# Altium project Full_Bridge_Converter.PrjPcb (part 1 of 2)
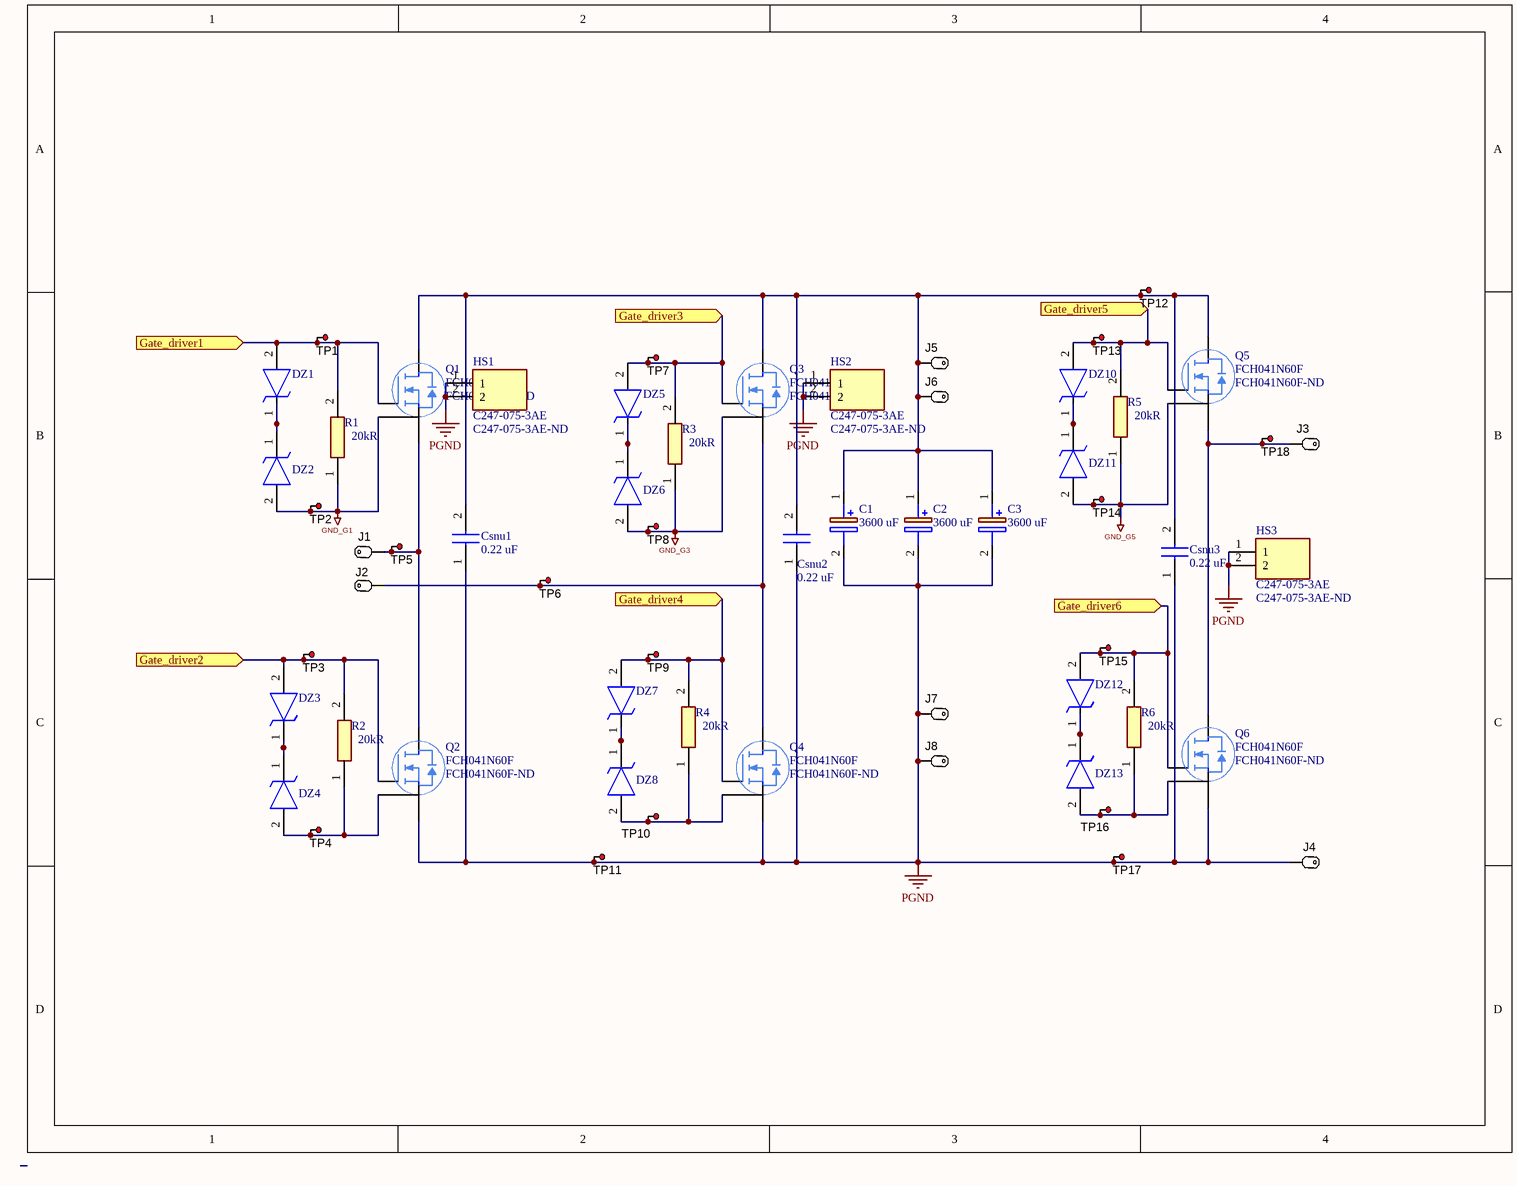
[diagram p0: Power_Card.SchDoc]
Company: Universidad de Costa Rica; Department: Escuela de Ingeniería Eléctrica; DesignByURL: Kaseng Fong Chen; Project: Convertidor de Puente H; VersionRevision: V1
5 sheets, 127 parts. Net scope: flat (ports and power ports of the same name join across sheets).
Sheets:
  Power_Card.SchDoc
  NuevosGateDriver.SchDoc
  FLYBACK.SchDoc
  Hardware.SchDoc
  Optic_PWM.SchDoc

## Sheet Power_Card.SchDoc
size Letter; SheetNumber: 1; SheetTotal: 4

### Parts
C1  3600 uF  [CAPPRD2220W900D5400H8200]
C2  3600 uF  [CAPPRD2220W900D5400H8200]
C3  3600 uF  [CAPPRD2220W900D5400H8200]
Csnu1  0.22 uF  [224PPB250K]
Csnu2  0.22 uF  [224PPB250K]
Csnu3  0.22 uF  [224PPB250K]
DZ1  SMA6J5.0A  [DIOM5026X229N]  (value not drawn)
DZ2  SMA6J5.0A  [DIOM5026X229N]  (value not drawn)
DZ3  SMA6J5.0A  [DIOM5026X229N]  (value not drawn)
DZ4  SMA6J5.0A  [DIOM5026X229N]  (value not drawn)
DZ5  SMA6J5.0A  [DIOM5026X229N]  (value not drawn)
DZ6  SMA6J5.0A  [DIOM5026X229N]  (value not drawn)
DZ7  SMA6J5.0A  [DIOM5026X229N]  (value not drawn)
DZ8  SMA6J5.0A  [DIOM5026X229N]  (value not drawn)
DZ10  SMA6J5.0A  [DIOM5026X229N]  (value not drawn)
DZ11  SMA6J5.0A  [DIOM5026X229N]  (value not drawn)
DZ12  SMA6J5.0A  [DIOM5026X229N]  (value not drawn)
DZ13  SMA6J5.0A  [DIOM5026X229N]  (value not drawn)
HS1  C247-075-3AE  Supplier Part Number 1: C247-075-3AE-ND  [C2470753AE]
HS2  C247-075-3AE  Supplier Part Number 1: C247-075-3AE-ND  [C2470753AE]
HS3  C247-075-3AE  Supplier Part Number 1: C247-075-3AE-ND  [C2470753AE]
J1  (no value)  [TE_62409-1]
J2  (no value)  [TE_62409-1]
J3  (no value)  [TE_62409-1]
J4  (no value)  [TE_62409-1]
J5  (no value)  [TE_62409-1]
J6  (no value)  [TE_62409-1]
J7  (no value)  [TE_62409-1]
J8  (no value)  [TE_62409-1]
Q1  FCH041N60F  Supplier Part Number 1: FCH041N60F-ND  [TO-247-4L_FCH041N60F]
Q2  FCH041N60F  Supplier Part Number 1: FCH041N60F-ND  [TO-247-4L_FCH041N60F]
Q3  FCH041N60F  Supplier Part Number 1: FCH041N60F-ND  [TO-247-4L_FCH041N60F]
Q4  FCH041N60F  Supplier Part Number 1: FCH041N60F-ND  [TO-247-4L_FCH041N60F]
Q5  FCH041N60F  Supplier Part Number 1: FCH041N60F-ND  [TO-247-4L_FCH041N60F]
Q6  FCH041N60F  Supplier Part Number 1: FCH041N60F-ND  [TO-247-4L_FCH041N60F]
R1  Resistance: 20kR  [RESC3216X70N]
R2  Resistance: 20kR  [RESC3216X70N]
R3  Resistance: 20kR  [RESC3216X70N]
R4  Resistance: 20kR  [RESC3216X70N]
R5  Resistance: 20kR  [RESC3216X70N]
R6  Resistance: 20kR  [RESC3216X70N]
TP1  5010  [Keystone5010]  (value not drawn)
TP2  5010  [Keystone5010]  (value not drawn)
TP3  5010  [Keystone5010]  (value not drawn)
TP4  5010  [Keystone5010]  (value not drawn)
TP5  5010  [Keystone5010]  (value not drawn)
TP6  5010  [Keystone5010]  (value not drawn)
TP7  5010  [Keystone5010]  (value not drawn)
TP8  5010  [Keystone5010]  (value not drawn)
TP9  5010  [Keystone5010]  (value not drawn)
TP10  5010  [Keystone5010]  (value not drawn)
TP11  5010  [Keystone5010]  (value not drawn)
TP12  5010  [Keystone5010]  (value not drawn)
TP13  5010  [Keystone5010]  (value not drawn)
TP14  5010  [Keystone5010]  (value not drawn)
TP15  5010  [Keystone5010]  (value not drawn)
TP16  5010  [Keystone5010]  (value not drawn)
TP17  5010  [Keystone5010]  (value not drawn)
TP18  5010  [Keystone5010]  (value not drawn)

### Ports
Gate_driver1 (in), Gate_driver2 (in), Gate_driver3 (in), Gate_driver4 (in), Gate_driver5 (in), Gate_driver6 (in)

### Nets
GND_G1: DZ2.2(A) Q1.3(S) R1.1 TP2.1
GND_G3: DZ6.2(A) Q3.3(S) R3.1 TP8.1
GND_G5: DZ11.2(A) Q5.3(S) R5.1 TP14.1
PGND: C1.2(-) C2.2(-) C3.2(-) Csnu1.1 Csnu2.1 Csnu3.1 HS1.1 HS1.2 HS2.1 HS2.2 HS3.1 HS3.2 J4.1(P1) J7.1(P1) J8.1(P1) Q2.2(Power_Source) Q4.2(Power_Source) Q6.2(Power_Source) TP11.1 TP17.1
NetC1_1: C1.1(+) C2.1(+) C3.1(+) Csnu1.2 Csnu2.2 Csnu3.2 J5.1(P1) J6.1(P1) Q1.1(D) Q3.1(D) Q5.1(D) TP12.1
NetDZ1_1: DZ1.1(K) DZ2.1(K)
NetDZ1_2: DZ1.2(A) Q1.4(G) R1.2 TP1.1 ; port Gate_driver1
NetDZ3_1: DZ3.1(K) DZ4.1(K)
NetDZ3_2: DZ3.2(A) Q2.4(G) R2.2 TP3.1 ; port Gate_driver2
NetDZ4_2: DZ4.2(A) Q2.3(S) R2.1 TP4.1
NetDZ5_1: DZ5.1(K) DZ6.1(K)
NetDZ5_2: DZ5.2(A) Q3.4(G) R3.2 TP7.1 ; port Gate_driver3
NetDZ7_1: DZ7.1(K) DZ8.1(K)
NetDZ7_2: DZ7.2(A) Q4.4(G) R4.2 TP9.1 ; port Gate_driver4
NetDZ8_2: DZ8.2(A) Q4.3(S) R4.1 TP10.1
NetDZ10_1: DZ10.1(K) DZ11.1(K)
NetDZ10_2: DZ10.2(A) Q5.4(G) R5.2 TP13.1 ; port Gate_driver5
NetDZ12_1: DZ12.1(K) DZ13.1(K)
NetDZ12_2: DZ12.2(A) Q6.4(G) R6.2 TP15.1 ; port Gate_driver6
NetDZ13_2: DZ13.2(A) Q6.3(S) R6.1 TP16.1
NetJ1_1: J1.1(P1) Q1.2(Power_Source) Q2.1(D) TP5.1
NetJ2_1: J2.1(P1) Q3.2(Power_Source) Q4.1(D) TP6.1
NetJ3_1: J3.1(P1) Q5.2(Power_Source) Q6.1(D) TP18.1

### Library data of the parts
C1-C3 = ALS70A362KE250: Capacitor Polarised; Manufacturer_Name: Kemet; Datasheet Link: https://www.mouser.co.cr/ProductDetail/KEMET/ALS70A362KE250?qs=%2Fha2pyFaduj3AQ8COxkE8lI%252BUillJnwqd3tsmY5wFt8h31rq7v%2FTZw%3D%3D; Height: 82mm; Manufacturer_Part_Number: ALS70A362KE250
Csnu1-Csnu3 = 224PPB250K: CAP FILM 0.22UF 10% 250VDC RAD; Manufacturer_Name: ILLINOIS CAPACITOR; Manufacturer: CDE Illinois Capacitor; Dielectric Material: PP; Capacitance: 220nF; Voltage Rating (DC): 250V; Voltage Rating (AC): 160V; Datasheet Link: https://componentsearchengine.com/Datasheets/1/224PPB250K.pdf; Height: 15mm; Manufacturer_Part_Number: 224PPB250K; Mouser Part Number: 598-224PPB250K; Mouser Price/Stock: https://www.mouser.com/Search/Refine.aspx?Keyword=598-224PPB250K; Supplier 1: Digi-Key; Supplier Part Number 1: 1572-1375-ND; Manufacturer Part Number: 224PPB250K; RoHS: Yes; Category: Film Capacitors; Stock 1: 173; Pricing 1: 1=1.84000, 10=1.44900, 50=1.25580, 100=1.08680, 500=0.82110, 1000=0.72450, 2500=0.67620, 5000=0.65205 (USD); Mount: Through Hole,PCB; Case/Package: Radial; Min Operating Temperature: -55°C; Max Operating Temperature: 105°C; Tolerance: 10%; Voltage Rating: 250V; Packaging: Bulk; Termination: PC Pins; Series: PPB; Length: 1.043inch; Width: 0.236inch; Height - Seated (Max): 0.591inch; Lead Pitch: 0.886inch; Lead Free: Lead Free; ComponentLink1URL: https://datasheet.ciiva.com/23627/1658054-23627330.pdf?src-supplier=Newark; ComponentLink1Description: https://datasheet.ciiva.com/23627/1658054-23627330.pdf?src-supplier=Newark; ComponentLink2URL: https://datasheet.ciiva.com/16310/ppb-16310486.pdf?src-supplier=Future+Electronics; ComponentLink2Description: https://datasheet.ciiva.com/16310/ppb-16310486.pdf?src-supplier=Future+Electronics
DZ1-DZ8 DZ10-DZ13 = SMA6J5.0A: NEXPERIA - BZV55-C15,115 - ZENER-DIODE, 15V, 0.5W, SOD-80C-2; Manufacturer_Name: LITTELFUSE; Datasheet Link: https://www.arrow.com/en/products/sma6j5.0a/littelfuse; Height: 2.29mm; Manufacturer_Part_Number: SMA6J5.0A; Supplier 1: Digi-Key; Manufacturer: Nexperia; Manufacturer Part Number: BZV55-C15,115; RoHS: Yes; Category: Zener Diodes; Stock 1: 165; Pricing 1: 1=0.19000, 10=0.17500, 100=0.09520, 500=0.05856, 1000=0.03993 (USD); RoHS Compliant: Yes; ComponentLink1URL: http://www.farnell.com/datasheets/1498690.pdf?src-supplier=Farnell; ComponentLink1Description: http://www.farnell.com/datasheets/1498690.pdf?src-supplier=Farnell; ComponentLink2URL: https://assets.nexperia.com/documents/data-sheet/BZV55_SER.pdf?src-supplier=Digi-Key; ComponentLink2Description: https://assets.nexperia.com/documents/data-sheet/BZV55_SER.pdf?src-supplier=Digi-Key; Supplier Part Number 1: 1727-4962-1-ND
HS1-HS3 = C247-075-3AE: Heatsink,  TO-247,  75 x 20.47 x 38mm,  Spring Clip Mount; Manufacturer_Name: Ohmite; Shape: Fins,Rectangular; Finish: Anodized; Thermal Resistance @ Forced Air Flow (100 LFM): 2°C/W; Datasheet Link: https://www.ohmite.com/assets/docs/sink_c.pdf; Height: 38mm; Manufacturer_Part_Number: C247-075-3AE; Supplier 1: Digi-Key; Manufacturer: Ohmite; Manufacturer Part Number: C247-075-3AE; RoHS: Yes; Category: Heat Sinks; Stock 1: 277; Pricing 1: 1=10.28000, 10=9.99900, 25=9.44360, 50=8.88800, 100=8.33250, 250=7.77700, 500=7.22150, 1000=7.08262 (USD); Mount: PC Pin,Board,Clip; Case/Package: TO-247; Weight: 1.6oz; Package Cooled: TO-247; Material: Aluminium; Color: Black; Packaging: Bulk; Package Quantity: 5; Type: Passive; Termination: Radial; Natural Thermal Resistance: 2°C/W; Series: C; Length: 75mm; Width: 1.5inch; Height Off Base: 0.71inch; REACH SVHC: Unknown; RoHS Compliant: Yes; ComponentLink1URL: https://datasheet.ciiva.com/1347/1491991-1347537.pdf?src-supplier=Element14; ComponentLink1Description: https://datasheet.ciiva.com/1347/1491991-1347537.pdf?src-supplier=Element14; ComponentLink2URL: https://datasheet.ciiva.com/30237/c-sink-30237933.pdf?src-supplier=Onlinecomponents.com; ComponentLink2Description: https://datasheet.ciiva.com/30237/c-sink-30237933.pdf?src-supplier=Onlinecomponents.com; ComponentLink3URL: https://datasheet.ciiva.com/16151/c-sink-16151064.pdf?src-supplier=Onlinecomponents.com; ComponentLink3Description: https://datasheet.ciiva.com/16151/c-sink-16151064.pdf?src-supplier=Onlinecomponents.com; ComponentLink4URL: https://datasheet.ciiva.com/14543/70024778-14543773.pdf?src-supplier=Allied+Electronics; ComponentLink4Description: https://datasheet.ciiva.com/14543/70024778-14543773.pdf?src-supplier=Allied+Electronics
J1-J8 = 62409-1: Quick Disconnect Terminal M 15.8mm 7.5mm Tin Over Copper Automotive Bag; Manufacturer: AMP - TE CONNECTIVITY; Supplier 1: Digi-Key; Supplier Part Number 1: A24742-ND; Manufacturer Part Number: 62409-1; RoHS: No; Stock 1: 8729; Pricing 1: 1=0,19000, 10=0,17800, 25=0,15200, 50=0,13320, 100=0,12360, 250=0,10936, 750=0,09035, 1500=0,08083, 8000=0,06895 (USD); ComponentLink1URL: http://www.farnell.com/datasheets/1650963.pdf?src-supplier=Farnell; ComponentLink1Description: http://www.farnell.com/datasheets/1650963.pdf?src-supplier=Farnell; ComponentLink2URL: http://www.farnell.com/datasheets/1650963.pdf?src-supplier=Element14; ComponentLink2Description: http://www.farnell.com/datasheets/1650963.pdf?src-supplier=Element14; ComponentLink3URL: http://www.farnell.com/datasheets/1650963.pdf?src-supplier=Newark; ComponentLink3Description: http://www.farnell.com/datasheets/1650963.pdf?src-supplier=Newark; ComponentLink4URL: https://www.te.com/commerce/DocumentDelivery/DDEController?Action=srchrtrv&DocNm=62409&DocType=Customer+Drawing&DocLang=English&src-supplier=Digi-Key; ComponentLink4Description: https://www.te.com/commerce/DocumentDelivery/DDEController?Action=srchrtrv&DocNm=62409&DocType=Customer+Drawing&DocLang=English&src-supplier=Digi-Key
Q1-Q6 = FCH041N60F: MOSFET 600V N-Channel MOSFET, FRFET; Manufacturer: ON Semiconductor / Fairchild; Continuous Drain Current (ID): 76A; Rds On Max: 41mR; Input Capacitance: 14.365nF; Rise Time: 66ns; Max Power Dissipation: 595W; Fall Time: 53ns; Gate to Source Voltage (Vgs): 20V; Turn-Off Delay Time: 244ns; Turn-On Delay Time: 63ns; Element Configuration: Single; Drain to Source Resistance: 36mR; Number of Elements: 1; ComponentLink3URL: https://datasheet.ciiva.com/28425/fch041n60f-28425574.pdf?src-supplier=Avnet+Europe; ComponentLink3Description: https://datasheet.ciiva.com/28425/fch041n60f-28425574.pdf?src-supplier=Avnet+Europe; Supplier 1: Digi-Key; Manufacturer Part Number: FCH041N60F; RoHS: Yes; Category: MOSFETs; Stock 1: 1157; Pricing 1: 1=9.07000, 10=8.19600, 25=7.81480, 100=6.78560, 500=6.06480 (USD); Mount: Through Hole; Case/Package: TO-247-3; Number of Pins: 3; Weight: 6.39g; Contact Plating: Tin,Matte; Min Operating Temperature: -55°C; Max Operating Temperature: 150°C; Packaging: Rail/Tube; Drain to Source Voltage (Vdss): 600V; Package Quantity: 30; Drain to Source Breakdown Voltage: 600V; Power Dissipation: 595W; Polarity: N-CHANNEL; Series: SuperFETII®; Length: 15.87mm; Width: 4.82mm; Height: 20.82mm; Radiation Hardening: No; Lead Free: Lead Free; RoHS Compliant: Yes; ComponentLink1URL: https://datasheet.ciiva.com/15043/fch041n60f-15043778.pdf?src-supplier=Digi-Key; ComponentLink1Description: https://datasheet.ciiva.com/15043/fch041n60f-15043778.pdf?src-supplier=Digi-Key; ComponentLink2URL: https://datasheet.ciiva.com/13058/fch041n60f-226495-13058758.pdf?src-supplier=Mouser; ComponentLink2Description: https://datasheet.ciiva.com/13058/fch041n60f-226495-13058758.pdf?src-supplier=Mouser
R1-R6 = RMCF1206JT20K0‎‎: RES SMD 20K OHM 5% 1/4W 1206; Manufacturer_Name: KOA Speer; Manufacturer_Part_Number: RN73H2BTTD1001B10; Manufacturer: Stackpole Electronics; Power Rating: 250mW; Temperature Coefficient: 200ppm/°C; Datasheet Link: https://www.mouser.de/datasheet/2/219/RN73H-1843478.pdf; Height: 0.7mm; Supplier 1: Digi-Key; Manufacturer Part Number: RMCF1206JT20K0; RoHS: Yes; Category: Chip SMD Resistors; Stock 1: 60988; Pricing 1: 1=0.10000, 10=0.02800, 100=0.01150, 1000=0.00518, 2500=0.00450 (USD); Mount: Surface Mount; Case/Package: 1206; Case Code (Metric): 3216; Case Code (Imperial): 1206; Contact Plating: Tin,Matte; Size Code: 1206; Min Operating Temperature: -55°C; Max Operating Temperature: 155°C; Tolerance: 5%; Packaging: Tape and Reel; Resistor Type: Thick Film; Number of Terminations: 2; Max Power Dissipation: 250mW; Features: Automotive AEC-Q200; Series: RMCF; Length: 0.126inch; Width: 0.063inch; Radiation Hardening: No; Lead Free: Lead Free; RoHS Compliant: Yes; ComponentLink1URL: http://components.arrow.com/part/dataview/43746691S7171900N1174?src-supplier=Arrow+Electronics; ComponentLink1Description: http://components.arrow.com/part/dataview/43746691S7171900N1174?src-supplier=Arrow+Electronics; ComponentLink2URL: https://www.seielect.com/catalog/SEI-RMCF_RMCP.pdf?src-supplier=Avnet; ComponentLink2Description: https://www.seielect.com/catalog/SEI-RMCF_RMCP.pdf?src-supplier=Avnet; ComponentLink3URL: https://www.seielect.com/Catalog/SEI-RMCF_RMCP.pdf?src-supplier=Digi-Key; ComponentLink3Description: https://www.seielect.com/Catalog/SEI-RMCF_RMCP.pdf?src-supplier=Digi-Key; ComponentLink4URL: https://www.seielect.com/catalog/SEI-Packaging.pdf?src-supplier=Digi-Key; ComponentLink4Description: https://www.seielect.com/catalog/SEI-Packaging.pdf?src-supplier=Digi-Key; ComponentLink5URL: http://www.seielect.com/Catalog/SEI-RMC.pdf?src-supplier=Future+Electronics; ComponentLink5Description: http://www.seielect.com/Catalog/SEI-RMC.pdf?src-supplier=Future+Electronics; Supplier Part Number 1: RMCF1206JT20K0CT-ND
TP1-TP18 = 5010: Test Point, Multipurpose, Red, TH; Manufacturer: Keystone; CompType: Test Point Loop; ContactFinish: Silver; SymbolVersion: 2008-04-04; PartNumber: 5010; PackageReference: Red Multipurpose Testpoint; RoHS: Y; MountType: TH; ComponentLink1Description: Datasheet URL; ComponentLink1URL: http://www.keyelco.com/userAssets/file/M60-2p60.pdf; Color: Red; Publisher: Texas Instruments; LatestRevisionDate: 2016-02-11; Supplier 1: Digi-Key; Supplier Part Number 1: 36-5010-ND; Supplier 2: Mouser; Supplier Part Number 2: 534-5010

## Sheet NuevosGateDriver.SchDoc
size A4; SheetNumber: 2; SheetTotal: 6
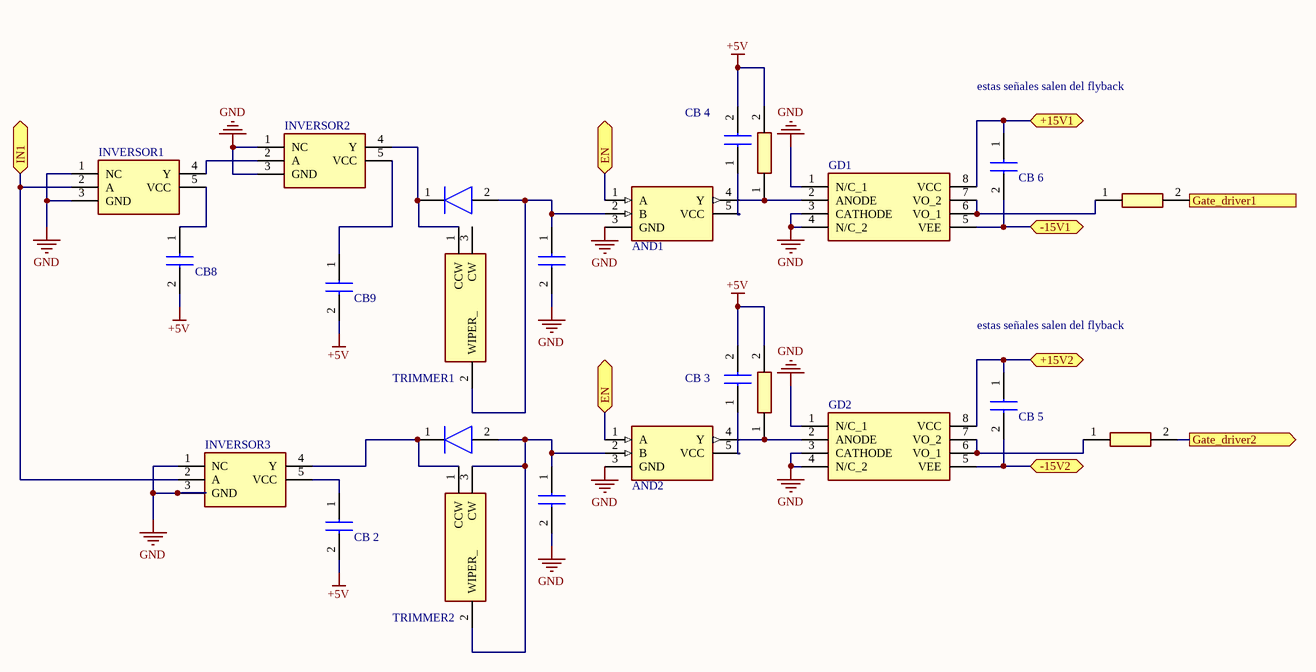
[diagram p1: NuevosGateDriver.SchDoc]

### Parts
AND1  SN74AHC1G09DCKR  [SOT65P210X110-5N]  (value not drawn)
AND2  SN74AHC1G09DCKR  [SOT65P210X110-5N]  (value not drawn)
CB8  0.1 uF  [CAPC2012X94N]  (value not drawn)
CB9  0.1 uF  [CAPC2012X94N]  (value not drawn)
CB_2  0.1 uF  [CAPC2012X94N]  (value not drawn)
CB_3  0.1 uF  [CAPC2012X94N]  (value not drawn)
CB_4  0.1 uF  [CAPC2012X94N]  (value not drawn)
CB_5  0.1 uF  [CAPC2012X94N]  (value not drawn)
CB_6  0.1 uF  [CAPC2012X94N]  (value not drawn)
CG1  C0805Y102K3RACTU  [CAPC2012X98N]  (value not drawn)
CG2  C0805Y102K3RACTU  [CAPC2012X98N]  (value not drawn)
DS1  BAS85-GS08  [BAQ33GS08]  (value not drawn)
DS2  BAS85-GS08  [BAQ33GS08]  (value not drawn)
GD1  HCPL-3120  [DIP762W65P254L965H470Q8N]  (value not drawn)
GD2  HCPL-3120  [DIP762W65P254L965H470Q8N]  (value not drawn)
GR1  RC0603JR-13100RL  [RESC1608X55N]  (value not drawn)
GR2  RC0603JR-13100RL  [RESC1608X55N]  (value not drawn)
GR3  RC0603JR-13100RL  [RESC1608X55N]  (value not drawn)
GR4  RC0603JR-13100RL  [RESC1608X55N]  (value not drawn)
INVERSOR1  SN74AHC1G14DRLR  [SOTFL50P160X60-5N]  (value not drawn)
INVERSOR2  SN74AHC1G14DRLR  [SOTFL50P160X60-5N]  (value not drawn)
INVERSOR3  SN74AHC1G14DRLR  [SOTFL50P160X60-5N]  (value not drawn)
TRIMMER1  ST-4ETB203  [ST4ETB203]  (value not drawn)
TRIMMER2  ST-4ETB203  [ST4ETB203]  (value not drawn)

### Ports
+15V1 (bidir), +15V2 (bidir), -15V1 (bidir), -15V2 (bidir), EN (bidir), Gate_driver1 (out), Gate_driver2 (out), IN1 (bidir)

### Nets
+5V: CB8.2 CB9.2 CB_2.2 CB_3.2 CB_4.2 GR1.2 GR2.2
GND: AND1.3(GND) AND2.3(GND) CG1.2 CG2.2 GD1.1(N/C_1) GD1.3(CATHODE) GD1.4(N/C_2) GD2.1(N/C_1) GD2.3(CATHODE) GD2.4(N/C_2) INVERSOR1.1(NC) INVERSOR1.3(GND) INVERSOR2.1(NC) INVERSOR2.3(GND) INVERSOR3.1(NC) INVERSOR3.3(GND)
NetAND1_1: AND1.1(A) AND2.1(A) ; port EN
NetAND1_2: AND1.2(B) CG1.1 DS1.2(A) TRIMMER1.2(WIPER_)
NetAND1_4: AND1.4(Y) GD1.2(ANODE) GR1.1
NetAND1_5: AND1.5(VCC) CB_4.1
NetAND2_2: AND2.2(B) CG2.1 DS2.2(A) TRIMMER2.2(WIPER_) TRIMMER2.3(CW)
NetAND2_4: AND2.4(Y) GD2.2(ANODE) GR2.1
NetAND2_5: AND2.5(VCC) CB_3.1
NetCB8_1: CB8.1 INVERSOR1.5(VCC)
NetCB9_1: CB9.1 INVERSOR2.5(VCC)
NetCB_2_1: CB_2.1 INVERSOR3.5(VCC)
NetCB_5_1: CB_5.1 GD2.8(VCC) ; port +15V2
NetCB_5_2: CB_5.2 GD2.5(VEE) ; port -15V2
NetCB_6_1: CB_6.1 GD1.8(VCC) ; port +15V1
NetCB_6_2: CB_6.2 GD1.5(VEE) ; port -15V1
NetDS1_1: DS1.1(K) INVERSOR2.4(Y) TRIMMER1.1(CCW)
NetDS2_1: DS2.1(K) INVERSOR3.4(Y) TRIMMER2.1(CCW)
NetDZ1_2: GR3.2 ; port Gate_driver1
NetDZ3_2: GR4.2 ; port Gate_driver2
NetGD1_6: GD1.6(VO_1) GD1.7(VO_2) GR3.1
NetGD2_6: GD2.6(VO_1) GD2.7(VO_2) GR4.1
NetINVERSOR1_2: INVERSOR1.2(A) INVERSOR3.2(A) ; port IN1
NetINVERSOR1_4: INVERSOR1.4(Y) INVERSOR2.2(A)

Not connected (* = marked no-connect by the designer): TRIMMER1 3(CW)

### Notes on the sheet
- estas señales salen del flyback

### Library data of the parts
AND1 AND2 = SN74AHC1G09DCKR: TEXAS INSTRUMENTS         SN74AHC1G09DCKR             AND Gate, ACH Family, 2 Input, 1 Gate, 25 mA, 2V to 5.5V, SC-70-5; Quiescent Current: 1uA; Output Current: 25mA; Number of Inputs: 2; Propagation Delay: 7.5ns; Number of Outputs: 1; Low Level Output Current: 8mA; Datasheet Link: http://www.ti.com/lit/gpn/sn74ahc1g09; Height: 1.1mm; Manufacturer_Name: Texas Instruments; Manufacturer_Part_Number: SN74AHC1G09DCKR; Supplier 1: Digi-Key; Manufacturer: Texas Instruments; Manufacturer Part Number: SN74AHC1G09DCKR; RoHS: Yes; Category: Logic Gates; Stock 1: 19244; Pricing 1: 1=0.40000, 10=0.29700, 25=0.25960, 100=0.16810, 250=0.13912, 500=0.11130, 1000=0.08533 (USD); Mount: Surface Mount; Case/Package: SC; Number of Pins: 5; Min Operating Temperature: -55°C; Max Operating Temperature: 125°C; Max Supply Voltage: 5.5V; Min Supply Voltage: 2V; Logic Function: AND GATE; Packaging: Tape and Reel; Package Quantity: 3000; Output Voltage: 5.5V; Number of Circuits: 1; Number of Gates: 1; Number of Elements: 1; Number of Bits: 1; Series: 74AHC; Technology: CMOS; Radiation Hardening: No; REACH SVHC: No SVHC; Lead Free: Lead Free; RoHS Compliant: Yes; ComponentLink1URL: https://datasheet.ciiva.com/1869/sn74ahc1g09-1869442.pdf?src-supplier=Digi-Key; ComponentLink1Description: https://datasheet.ciiva.com/1869/sn74ahc1g09-1869442.pdf?src-supplier=Digi-Key; ComponentLink2URL: https://datasheet.ciiva.com/4817/scls724b-115396-4817364.pdf?src-supplier=Mouser; ComponentLink2Description: https://datasheet.ciiva.com/4817/scls724b-115396-4817364.pdf?src-supplier=Mouser; ComponentLink3URL: https://datasheet.ciiva.com/1869/sn74ahc1g09-1869443.pdf?src-supplier=Digi-Key; ComponentLink3Description: https://datasheet.ciiva.com/1869/sn74ahc1g09-1869443.pdf?src-supplier=Digi-Key; ComponentLink4URL: https://datasheet.ciiva.com/1869/sn74ahc1g09-1869444.pdf?src-supplier=Digi-Key; ComponentLink4Description: https://datasheet.ciiva.com/1869/sn74ahc1g09-1869444.pdf?src-supplier=Digi-Key; ComponentLink5URL: https://datasheet.ciiva.com/14310/sn74ahc1g09-14310535.pdf?src-supplier=Avnet; ComponentLink5Description: https://datasheet.ciiva.com/14310/sn74ahc1g09-14310535.pdf?src-supplier=Avnet; ComponentLink6URL: https://datasheet.ciiva.com/41677/1864448-41677365.pdf?src-supplier=Newark; ComponentLink6Description: https://datasheet.ciiva.com/41677/1864448-41677365.pdf?src-supplier=Newark; Supplier Part Number 1: 296-29203-1-ND
CB8 CB9 CB_2-CB_6 = 0805YC104KAT2A: Multilayer Ceramic Capacitors MLCC - SMD/SMT 16V .1uF X7R 0805 10%; Manufacturer_Name: AVX; Manufacturer: Kyocera AVX; Capacitance: 100nF; Dissipation Factor: 12.5%; Insulation Resistance: 100GR; Datasheet Link: https://spicat.avx.com/product/mlcc/chartview/0805YC104KAT2A/DataSheet/X7R; Height: 0.94mm; Manufacturer_Part_Number: 0805YC104KAT2A; Mouser Part Number: 581-0805YC104K; Mouser Price/Stock: https://www.mouser.co.uk/ProductDetail/AVX/0805YC104KAT2A?qs=0j3vzYx9OgS3bRufCc82qg%3D%3D; Arrow Part Number: 0805YC104KAT2A; Arrow Price/Stock: https://www.arrow.com/en/products/0805yc104kat2a/avx; Supplier 1: Digi-Key; Manufacturer Part Number: 0805YC104KAT2A; RoHS: Yes; Category: Ceramic Capacitors; Stock 1: 61419; Pricing 1: 1=0.30000, 10=0.20700, 50=0.12420, 100=0.10490, 500=0.07176, 1000=0.06348 (USD); Mount: Surface Mount; Case/Package: 0805; Number of Pins: 2; Case Code (Metric): 2012; Case Code (Imperial): 0805; Min Operating Temperature: -55°C; Max Operating Temperature: 125°C; Tolerance: 10%; Dielectric: X7R; Packaging: Tape and Reel; Voltage Rating: 16V; Package Quantity: 1; Termination: SMD/SMT; Voltage Rating (DC): 16V; Series: -; Construction: Flat; Length: 2.01mm; Width: 0.049inch; Depth: 1.25mm; Thickness: 0.037inch; Radiation Hardening: No; REACH SVHC: No SVHC; Lead Free: Lead Free; RoHS Compliant: Yes; ComponentLink1URL: https://datasheet.ciiva.com/206/cx7r-206011.pdf?src-supplier=Digi-Key; ComponentLink1Description: https://datasheet.ciiva.com/206/cx7r-206011.pdf?src-supplier=Digi-Key; ComponentLink2URL: https://datasheet.ciiva.com/5418/cx7r-5418479.pdf?src-supplier=Mouser; ComponentLink2Description: https://datasheet.ciiva.com/5418/cx7r-5418479.pdf?src-supplier=Mouser; ComponentLink3URL: https://datasheet.ciiva.com/2988/cx7r-2988050.pdf?src-supplier=Avnet; ComponentLink3Description: https://datasheet.ciiva.com/2988/cx7r-2988050.pdf?src-supplier=Avnet; ComponentLink4URL: https://datasheet.ciiva.com/14906/cx7r-14906278.pdf?src-supplier=Digi-Key; ComponentLink4Description: https://datasheet.ciiva.com/14906/cx7r-14906278.pdf?src-supplier=Digi-Key; ComponentLink5URL: https://datasheet.ciiva.com/15212/getdatasheetpartid-150472-15212621.pdf?src-supplier=Verical; ComponentLink5Description: https://datasheet.ciiva.com/15212/getdatasheetpartid-150472-15212621.pdf?src-supplier=Verical; ComponentLink6URL: https://datasheet.ciiva.com/28613/1679506-28613143.pdf?src-supplier=Element14; ComponentLink6Description: https://datasheet.ciiva.com/28613/1679506-28613143.pdf?src-supplier=Element14; ComponentLink7URL: https://datasheet.ciiva.com/16623/cx7r-16623414.pdf?src-supplier=Avnet+Europe; ComponentLink7Description: https://datasheet.ciiva.com/16623/cx7r-16623414.pdf?src-supplier=Avnet+Europe; Supplier Part Number 1: 478-7961-1-ND
CG1 CG2 = C0805Y102K3RACTU: Multilayer Ceramic Capacitors MLCC - SMD/SMT 25volts 1000pF 10% X7R; Manufacturer_Name: Kemet; Capacitance: 1nF; Voltage Rating (DC): 25V; Datasheet Link: https://www.kemet.com/specsheet/C0805Y102K3RACTU; Height: 0.98mm; Manufacturer_Part_Number: C0805Y102K3RACTU; Mouser Part Number: 80-C0805Y102K3R; Mouser Price/Stock: https://www.mouser.com/Search/Refine.aspx?Keyword=80-C0805Y102K3R; Manufacturer: KEMET; Manufacturer Part Number: C0805Y102K3RACTU; RoHS: Yes; Category: Capacitors; Stock 1: 8015; Pricing 1: 1=0.43000, 10=0.30100, 50=0.30100, 100=0.18100, 1000=0.11400, 10000=0.10200 (USD); Case/Package: 0805; Case Code (Imperial): 0805; Case Code (Metric): 2012; Weight: 0.000194oz; Dielectric Material: Ceramic; Min Operating Temperature: -55°C; Max Operating Temperature: 125°C; Packaging: Tape and Reel; Tolerance: 10%; Dielectric: X7R; Termination: SMD/SMT; Series: C0805Y; RoHS Compliant: Yes; ComponentLink1URL: http://www.mouser.com/ds/2/212/KEM_C1015_X7R_FF-CAP_SMD-1101148.pdf?src-supplier=Mouser; ComponentLink1Description: http://www.mouser.com/ds/2/212/KEM_C1015_X7R_FF-CAP_SMD-1101148.pdf?src-supplier=Mouser
  CG1: Supplier 1: Digi-Key; Supplier Part Number 1: 399-15433-1-ND
  CG2: Supplier 1: Mouser; Supplier Part Number 1: 80-C0805Y102K3R
DS1 DS2 = BAS85-GS08: VISHAY - BAS85-GS08 - Small Signal Schottky Diode, Single, 30 V, 200 mA, 800 mV, 600 mA, 125 °C; Manufacturer: Vishay Semiconductors; Recovery Time: 5ns; Max Surge Current: 600mA; Forward Voltage: 800mV; Forward Current: 200mA; Max Reverse Current: 2uA; Max Repetitive Reverse Voltage (Vrrm): 30V; Power Dissipation: 200mW; Current Rating: 200A; Datasheet Link: https://www.vishay.com/docs/85510/bas85.pdf; Height: 1.6mm; Manufacturer_Name: Vishay; Manufacturer_Part_Number: BAS85-GS08; Supplier 1: Allied Electronics; Manufacturer Part Number: BAS85-GS08; RoHS: Yes; Category: Rectifier Diodes; Stock 1: 12500; Pricing 1: 1=0.06300, 12500=0.06000, 625000=0.05900 (USD); Mount: Surface Mount; Number of Pins: 2; Contact Plating: Tin,Silver; Min Operating Temperature: -55°C; Max Operating Temperature: 125°C; Package Quantity: 1; Packaging: Tape and Reel; Average Rectified Current: 200mA; Reverse Recovery Time: 5ns; Max Reverse Leakage Current: 2uA; Peak Non-Repetitive Surge Current: 600mA; Max Forward Surge Current (Ifsm): 600mA; Element Configuration: Single; Current: 200mA; Voltage: 30V; Max Reverse Voltage (DC): 30V; Diameter: 1.6mm; Length: 0.145inch; Width: 1.6mm; Radiation Hardening: No; REACH SVHC: Unknown; Lead Free: Lead Free; RoHS Compliant: Yes; ComponentLink1URL: https://datasheet.ciiva.com/1202/1354484-1202985.pdf?src-supplier=Farnell; ComponentLink1Description: https://datasheet.ciiva.com/1202/1354484-1202985.pdf?src-supplier=Farnell; ComponentLink2URL: https://datasheet.ciiva.com/4715/bas85-88986-4715157.pdf?src-supplier=Mouser; ComponentLink2Description: https://datasheet.ciiva.com/4715/bas85-88986-4715157.pdf?src-supplier=Mouser; ComponentLink3URL: https://datasheet.ciiva.com/17069/0900766b80de2cb8-17069417.pdf?src-supplier=Allied+Electronics; ComponentLink3Description: https://datasheet.ciiva.com/17069/0900766b80de2cb8-17069417.pdf?src-supplier=Allied+Electronics; ComponentLink4URL: https://datasheet.ciiva.com/1240/1749352-1240576.pdf?src-supplier=Newark; ComponentLink4Description: https://datasheet.ciiva.com/1240/1749352-1240576.pdf?src-supplier=Newark; ComponentLink5URL: https://datasheet.ciiva.com/13950/bas85-13950054.pdf?src-supplier=Digi-Key; ComponentLink5Description: https://datasheet.ciiva.com/13950/bas85-13950054.pdf?src-supplier=Digi-Key; ComponentLink6URL: https://datasheet.ciiva.com/13950/bas85-13950058.pdf?src-supplier=Digi-Key; ComponentLink6Description: https://datasheet.ciiva.com/13950/bas85-13950058.pdf?src-supplier=Digi-Key; ComponentLink7URL: https://datasheet.ciiva.com/8281/bas85-8281903.pdf?src-supplier=Avnet; ComponentLink7Description: https://datasheet.ciiva.com/8281/bas85-8281903.pdf?src-supplier=Avnet; ComponentLink8URL: https://datasheet.ciiva.com/16298/bas85-16298175.pdf?src-supplier=Future+Electronics; ComponentLink8Description: https://datasheet.ciiva.com/16298/bas85-16298175.pdf?src-supplier=Future+Electronics; ComponentLink9URL: https://datasheet.ciiva.com/16941/70061833-16941564.pdf?src-supplier=Allied+Electronics; ComponentLink9Description: https://datasheet.ciiva.com/16941/70061833-16941564.pdf?src-supplier=Allied+Electronics; ComponentLink10URL: https://datasheet.ciiva.com/25936/bas85-25936302.pdf?src-supplier=Avnet+Europe; ComponentLink10Description: https://datasheet.ciiva.com/25936/bas85-25936302.pdf?src-supplier=Avnet+Europe; Supplier Part Number 1: 70062025
GD1 GD2 = HCPL-3120: Optocoupler Drive Push-Pull 1-CH 30V 1500V 8-Pin PDIP; Manufacturer_Name: Avago Technologies; Manufacturer: Broadcom Avago; Number of Channels: 1; Propagation Delay: 500ns; Rise Time: 100ns; Pulse Width Distortion (PWD): 300ns; Direction: Unidirectional; Max Power Dissipation: 295mW; Forward Current: 25mA; Forward Voltage: 1.5V; Reverse Breakdown Voltage: 5V; High Level Output Current: 2A; Fall Time: 0.1us; Isolation Voltage: 3.75kV; Max Output Current: 2.5A; Input Type: DC; Approvals: CSA,UR; Datasheet Link: https://docs.broadcom.com/docs/AV02-0161EN; Height: 4.7mm; Mouser2 Part Number: 630-HCPL-3120; Mouser2 Price/Stock: https://www.mouser.com/Search/Refine.aspx?Keyword=630-HCPL-3120; Manufacturer_Part_Number: HCPL-3120; Supplier 1: Digi-Key; Manufacturer Part Number: HCPL-3120; RoHS: No; Category: Optocouplers; Stock 1: 3108; Pricing 1: 1=4.42000, 10=3.12300, 100=2.55790, 500=2.15642, 1000=2.10450 (USD); Mount: Through Hole; Case/Package: PDIP; Number of Pins: 8; Min Operating Temperature: -40°C; Max Operating Temperature: 100°C; Packaging: Rail/Tube; Package Quantity: 50; Series: -; Low Level Output Current: 2A; Turn-On Delay Time: 500ns; Number of Elements: 1; Power Dissipation: 295mW; Output Type: PUSH-PULL; Radiation Hardening: No; RoHS Compliant: No; Lead Free: Contains Lead; ComponentLink1URL: https://datasheet.ciiva.com/19453/1550434-19453924.pdf?src-supplier=Jameco; ComponentLink1Description: https://datasheet.ciiva.com/19453/1550434-19453924.pdf?src-supplier=Jameco; ComponentLink2URL: https://datasheet.ciiva.com/15119/getdatasheetpartid-141584-15119757.pdf?src-supplier=Verical; ComponentLink2Description: https://datasheet.ciiva.com/15119/getdatasheetpartid-141584-15119757.pdf?src-supplier=Verical; Supplier Part Number 1: 516-1121-5-ND
GR1 GR2 = RC0603JR-13100RL: YAGEO - RC0603JR-13100RL - RES, THICK FILM, 100R, 5%, 0.1W, 0603; Manufacturer_Name: YAGEO (PHYCOMP); Resistance: 47; Power Rating: 100mW; Voltage Rating: 50V; Temperature Coefficient: 100ppm/°C; Datasheet Link: http://www.yageo.com/documents/recent/PYu-RC0603_51_RoHS_L_v5.pdf; Height: 0.55mm; Manufacturer_Part_Number: RC0603JR-13100RL; Supplier 1: Digi-Key; Manufacturer: Yageo; Manufacturer Part Number: RC0603JR-13100RL; RoHS: Yes; Category: Chip SMD Resistors; Stock 1: 37865; Pricing 1: 1=0.10000, 10=0.02000, 100=0.00800, 1000=0.00360, 2500=0.00312, 5000=0.00258 (USD); Case/Package: 0603; Number of Pins: 2; Case Code (Imperial): 0603; Case Code (Metric): 1608; Min Operating Temperature: -55°C; Max Operating Temperature: 155°C; Tolerance: 5%; Packaging: Tape and Reel; Resistor Type: Thick Film; Termination: SMD/SMT; Voltage Rating (DC): 50V; Series: RC; Construction: Rectangular; Resistance Tolerance: 5%; Length: 1.6mm; Width: 0.8mm; Depth: 0.8mm; REACH SVHC: No SVHC; Military Standard: Not; Lead Free: Lead Free; RoHS Compliant: Yes; ComponentLink1URL: https://datasheet.ciiva.com/12558/rc0603-272842-12558903.pdf?src-supplier=Mouser; ComponentLink1Description: https://datasheet.ciiva.com/12558/rc0603-272842-12558903.pdf?src-supplier=Mouser; ComponentLink2URL: https://datasheet.ciiva.com/7983/443971-7983750.pdf?src-supplier=Element14; ComponentLink2Description: https://datasheet.ciiva.com/7983/443971-7983750.pdf?src-supplier=Element14; Supplier Part Number 1: 13-RC0603JR-13100RLCT-ND
GR3 GR4 = RC0603JR-13100RL: Res Thick Film 1218 47 Ohm 5% 1W ±200ppm/C Pad SMD Automotive T/R; Manufacturer_Name: YAGEO (PHYCOMP); Manufacturer: Yageo; Resistance: 100R; Power Rating: 100mW; Voltage Rating: 50V; Temperature Coefficient: 100ppm/°C; Datasheet Link: http://www.yageo.com/documents/recent/PYu-RC0603_51_RoHS_L_v5.pdf; Height: 0.55mm; Manufacturer_Part_Number: RC0603JR-13100RL; Supplier 1: Digi-Key; Manufacturer Part Number: RC0603JR-13100RL; RoHS: Yes; Category: Chip SMD Resistors; Stock 1: 37865; Pricing 1: 1=0.10000, 10=0.02000, 100=0.00800, 1000=0.00360, 2500=0.00312, 5000=0.00258 (USD); Case/Package: 0603; Number of Pins: 2; Case Code (Imperial): 0603; Case Code (Metric): 1608; Min Operating Temperature: -55°C; Max Operating Temperature: 155°C; Tolerance: 5%; Packaging: Tape and Reel; Resistor Type: Thick Film; Termination: SMD/SMT; Voltage Rating (DC): 50V; Series: RC; Construction: Rectangular; Resistance Tolerance: 5%; Length: 1.6mm; Width: 0.8mm; Depth: 0.8mm; REACH SVHC: No SVHC; Military Standard: Not; Lead Free: Lead Free; RoHS Compliant: Yes; ComponentLink1URL: https://datasheet.ciiva.com/12558/rc0603-272842-12558903.pdf?src-supplier=Mouser; ComponentLink1Description: https://datasheet.ciiva.com/12558/rc0603-272842-12558903.pdf?src-supplier=Mouser; ComponentLink2URL: https://datasheet.ciiva.com/7983/443971-7983750.pdf?src-supplier=Element14; ComponentLink2Description: https://datasheet.ciiva.com/7983/443971-7983750.pdf?src-supplier=Element14; Supplier Part Number 1: 13-RC0603JR-13100RLCT-ND; ComponentLink3Description: New link; ComponentLink3URL: *; Supplier 2: Digi-Key; Supplier Part Number 2: RCL47BCT-ND; Stock 2: 6113; Pricing 2: 1=0.62000, 10=0.47600, 100=0.20010, 1000=0.11040 (USD); Weight: 0.001041oz; Package Quantity: 4000; Number of Terminations: 2; Max Power Dissipation: 1W; Features: Automotive AEC-Q200; Height - Seated (Max): 0.024inch; ComponentLink4URL: https://datasheet.ciiva.com/2480/dcrcwe3-2480270.pdf?src-supplier=Digi-Key; ComponentLink4Description: https://datasheet.ciiva.com/2480/dcrcwe3-2480270.pdf?src-supplier=Digi-Key; ComponentLink5URL: https://datasheet.ciiva.com/2480/rcle3-2480271.pdf?src-supplier=Digi-Key; ComponentLink5Description: https://datasheet.ciiva.com/2480/rcle3-2480271.pdf?src-supplier=Digi-Key; ComponentLink6URL: https://datasheet.ciiva.com/2480/rcle3-2480272.pdf?src-supplier=Digi-Key; ComponentLink6Description: https://datasheet.ciiva.com/2480/rcle3-2480272.pdf?src-supplier=Digi-Key; ComponentLink7Description: New link; ComponentLink7URL: *; ComponentLink8Description: New link; ComponentLink8URL: *
INVERSOR1-INVERSOR3 = SN74AHC1G14DRLR: IC INVERTER SCHMITT 1CH SOT5; Manufacturer_Name: Texas Instruments; Number of Inputs: 1; Propagation Delay: 10.6ns; Max Supply Voltage: 5.5V; Min Supply Voltage: 2V; Logic Function: Inverting,Schmitt Trigger,Inverter; Quiescent Current: 1uA; High Level Output Current: -8mA; Low Level Output Current: 8mA; Turn-On Delay Time: 18.5ns; Input Type: SCHMITT TRIGGER; Operating Supply Voltage: 5V; Datasheet Link: http://www.ti.com/lit/gpn/sn74ahc1g14; Height: 0.6mm; Mouser2 Part Number: 595-SN74AHC1G14DRLR; Mouser2 Price/Stock: https://www.mouser.com/Search/Refine.aspx?Keyword=595-SN74AHC1G14DRLR; Manufacturer_Part_Number: SN74AHC1G14DRLR; Supplier 1: Digi-Key; Manufacturer: Texas Instruments; Manufacturer Part Number: SN74AHC1G14DRLR; RoHS: Yes; Category: Logic Gates; Stock 1: 2029; Pricing 1: 1=0.51000, 10=0.41400, 25=0.37840, 100=0.28150, 250=0.25516, 500=0.21116, 1000=0.15836 (USD); Mount: Surface Mount; Case/Package: SOT-553; Number of Pins: 5; Weight: 9.9E-05oz; Min Operating Temperature: -40°C; Max Operating Temperature: 125°C; Package Quantity: 4000; Packaging: Cut Tape; Number of Elements: 1; Number of Circuits: 1; Number of Gates: 1; Number of Bits: 1; Series: SN74AHC1G14; Radiation Hardening: No; Lead Free: Lead Free; RoHS Compliant: Yes; ComponentLink1URL: https://datasheet.ciiva.com/1866/sn74ahc1g14-1866325.pdf?src-supplier=Digi-Key; ComponentLink1Description: https://datasheet.ciiva.com/1866/sn74ahc1g14-1866325.pdf?src-supplier=Digi-Key; Supplier Part Number 1: 296-23232-1-ND
TRIMMER1 TRIMMER2 = ST-4ETB203: TRIMMER 20K OHM 0.25W SMD; Manufacturer_Name: NIDEC COPAL; Resistance: 20kR; Tolerance: 20%; Number of Turns: 1; Max Power Dissipation: 250mW; Temperature Coefficient: 100ppm/°C; Datasheet Link: https://www.nidec-copal-electronics.com/e/catalog/trimmer/st-4.pdf; Height: 2.6mm; Manufacturer_Part_Number: ST-4ETB203; Supplier 1: Digi-Key; Manufacturer: Nidec Copal; Manufacturer Part Number: ST4ETB203; RoHS: Yes; Category: Variable Resistors and Potentiometers; Stock 1: 792; Pricing 1: 1=1.20000, 10=1.06000, 25=0.95440, 50=0.91920, 100=0.88380, 250=0.83072 (USD); Mount: Surface Mount; Color: Black; Weight: 120mg; Min Operating Temperature: -55°C; Max Operating Temperature: 125°C; Termination: Gull Wing; Packaging: Tape and Reel; Resistor Type: Cermet; Series: ST4; Length: 0.197inch; Width: 0.177inch; Radiation Hardening: No; Lead Free: Lead Free; ComponentLink1URL: https://datasheet.ciiva.com/2157/st-4-2157765.pdf?src-supplier=Digi-Key; ComponentLink1Description: https://datasheet.ciiva.com/2157/st-4-2157765.pdf?src-supplier=Digi-Key; ComponentLink2URL: https://datasheet.ciiva.com/2157/st-4-2157766.pdf?src-supplier=Digi-Key; ComponentLink2Description: https://datasheet.ciiva.com/2157/st-4-2157766.pdf?src-supplier=Digi-Key; Supplier Part Number 1: ST4ETB203CT-ND

## Sheet FLYBACK.SchDoc
size A4; SheetNumber: 3; SheetTotal: 4
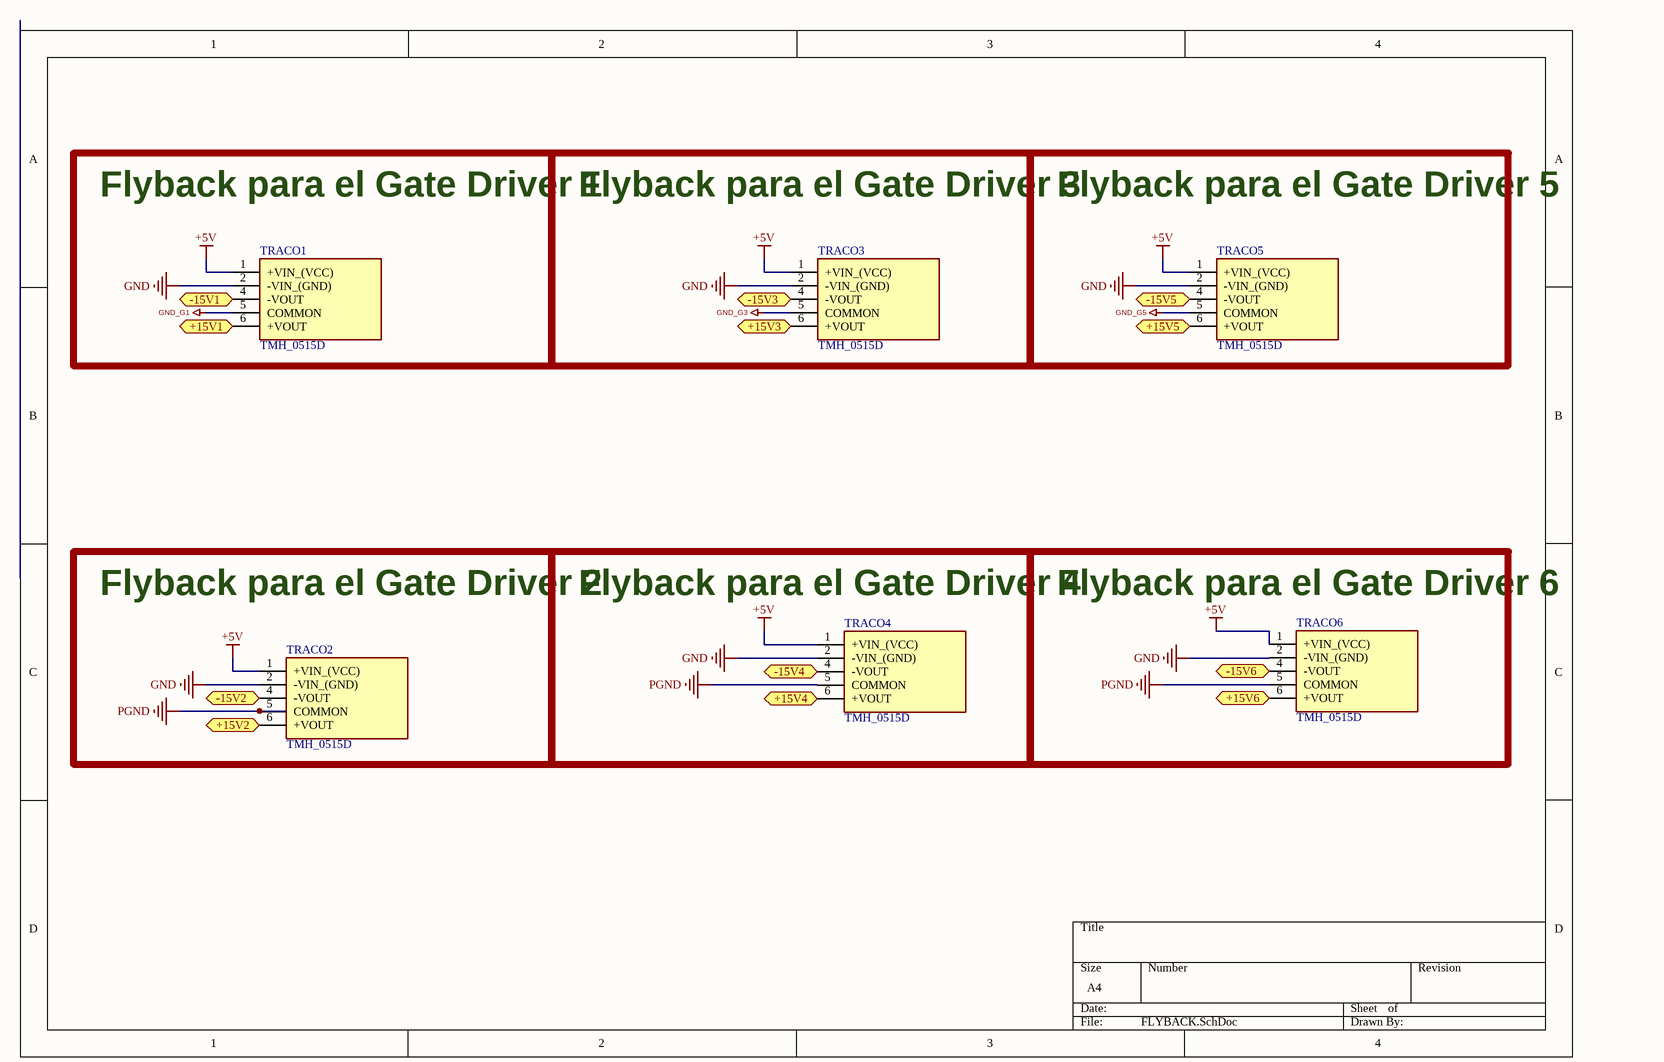
[diagram p2: FLYBACK.SchDoc]

### Parts
TRACO1  TMH_0515D  [TMH0515D]
TRACO2  TMH_0515D  [TMH0515D]
TRACO3  TMH_0515D  [TMH0515D]
TRACO4  TMH_0515D  [TMH0515D]
TRACO5  TMH_0515D  [TMH0515D]
TRACO6  TMH_0515D  [TMH0515D]

### Blocks framed on the sheet
Flyback para el Gate Driver 1: TRACO1
Flyback para el Gate Driver 3: TRACO3
Flyback para el Gate Driver 5: TRACO5
Flyback para el Gate Driver 2: TRACO2
Flyback para el Gate Driver 4: TRACO4
Flyback para el Gate Driver 6: TRACO6

### Ports
+15V1 (bidir), +15V2 (bidir), +15V3 (bidir), +15V4 (bidir), +15V5 (bidir), +15V6 (bidir), -15V1 (bidir), -15V2 (bidir), -15V3 (bidir), -15V4 (bidir), -15V5 (bidir), -15V6 (bidir)

### Nets
+5V: TRACO1.1(+VIN_(VCC)) TRACO2.1(+VIN_(VCC)) TRACO3.1(+VIN_(VCC)) TRACO4.1(+VIN_(VCC)) TRACO5.1(+VIN_(VCC)) TRACO6.1(+VIN_(VCC))
GND: TRACO1.2(-VIN_(GND)) TRACO2.2(-VIN_(GND)) TRACO3.2(-VIN_(GND)) TRACO4.2(-VIN_(GND)) TRACO5.2(-VIN_(GND)) TRACO6.2(-VIN_(GND))
GND_G1: TRACO1.5(COMMON)
GND_G3: TRACO3.5(COMMON)
GND_G5: TRACO5.5(COMMON)
PGND: TRACO2.5(COMMON) TRACO4.5(COMMON) TRACO6.5(COMMON)
NetCB_5_1: TRACO2.6(+VOUT) ; port +15V2
NetCB_5_2: TRACO2.4(-VOUT) ; port -15V2
NetCB_6_1: TRACO1.6(+VOUT) ; port +15V1
NetCB_6_2: TRACO1.4(-VOUT) ; port -15V1
NetTRACO3_4: TRACO3.4(-VOUT) ; port -15V3
NetTRACO3_6: TRACO3.6(+VOUT) ; port +15V3
NetTRACO4_4: TRACO4.4(-VOUT) ; port -15V4
NetTRACO4_6: TRACO4.6(+VOUT) ; port +15V4
NetTRACO5_4: TRACO5.4(-VOUT) ; port -15V5
NetTRACO5_6: TRACO5.6(+VOUT) ; port +15V5
NetTRACO6_4: TRACO6.4(-VOUT) ; port -15V6
NetTRACO6_6: TRACO6.6(+VOUT) ; port +15V6

### Library data of the parts
TRACO1-TRACO6 = TMH_0515D: DC/DC CONVERTER; Manufacturer_Name: Traco Power; Manufacturer_Part_Number: TMH 0515D; Nominal Input Voltage: 5V; Output Voltage: 15V; Output Current: 65mA; Number of Outputs: 2; Efficiency: 79%; Output Power: 2W; Max Input Voltage: 5.5V; Min Input Voltage: 4.5V; Voltage - Output 2: -15V; Isolation Voltage: 1kV; Isolation: Isolated; Datasheet Link: https://componentsearchengine.com//TMH 0515D.pdf; Height: 10.45mm; Mouser2 Part Number: 495-TMH-0515D; Mouser2 Price/Stock: https://www.mouser.com/Search/Refine.aspx?Keyword=495-TMH-0515D; Supplier 1: Digi-Key; Manufacturer: Traco Power; Manufacturer Part Number: TMH0515D; RoHS: Yes; Category: Voltage Regulators - Switching; Stock 1: 615; Pricing 1: 1=7.20000, 10=6.97900, 25=6.77400, 50=6.56880, 100=6.36350, 250=6.15824, 500=5.74770 (USD); Mount: Through Hole; Case/Package: SIP; Number of Pins: 5; Weight: 2.7g; Min Operating Temperature: -40°C; Max Operating Temperature: 75°C; Max Output Current: 65mA; Min Input Voltage (DC): 4.5V; Max Input Voltage (DC): 5.5V; Max Output Power: 2W; Voltage - Output 1: 15V; Current - Output 1: 65mA; Current - Output 2: 65mA; Series: TMH; Length: 19.5mm; Width: 7.5mm; Depth: 7.5mm; Radiation Hardening: No; REACH SVHC: No SVHC; Flammability Rating: UL94 V-0; RoHS Compliant: Yes; ComponentLink1URL: https://datasheet.ciiva.com/26336/157182-da-01-en-dc-dc-wandler-tmh-0515d-26336256.pdf?src-supplier=Conrad; ComponentLink1Description: https://datasheet.ciiva.com/26336/157182-da-01-en-dc-dc-wandler-tmh-0515d-26336256.pdf?src-supplier=Conrad; ComponentLink2URL: https://datasheet.ciiva.com/46393/1648746-46393670.pdf?src-supplier=Element14; ComponentLink2Description: https://datasheet.ciiva.com/46393/1648746-46393670.pdf?src-supplier=Element14; ComponentLink3URL: https://datasheet.ciiva.com/3356/tmh-eng-tds-3356425.pdf?src-supplier=Distrelec; ComponentLink3Description: https://datasheet.ciiva.com/3356/tmh-eng-tds-3356425.pdf?src-supplier=Distrelec; Supplier Part Number 1: 1951-2669-ND

## Sheet Hardware.SchDoc
size Letter; SheetNumber: 5; SheetTotal: 5
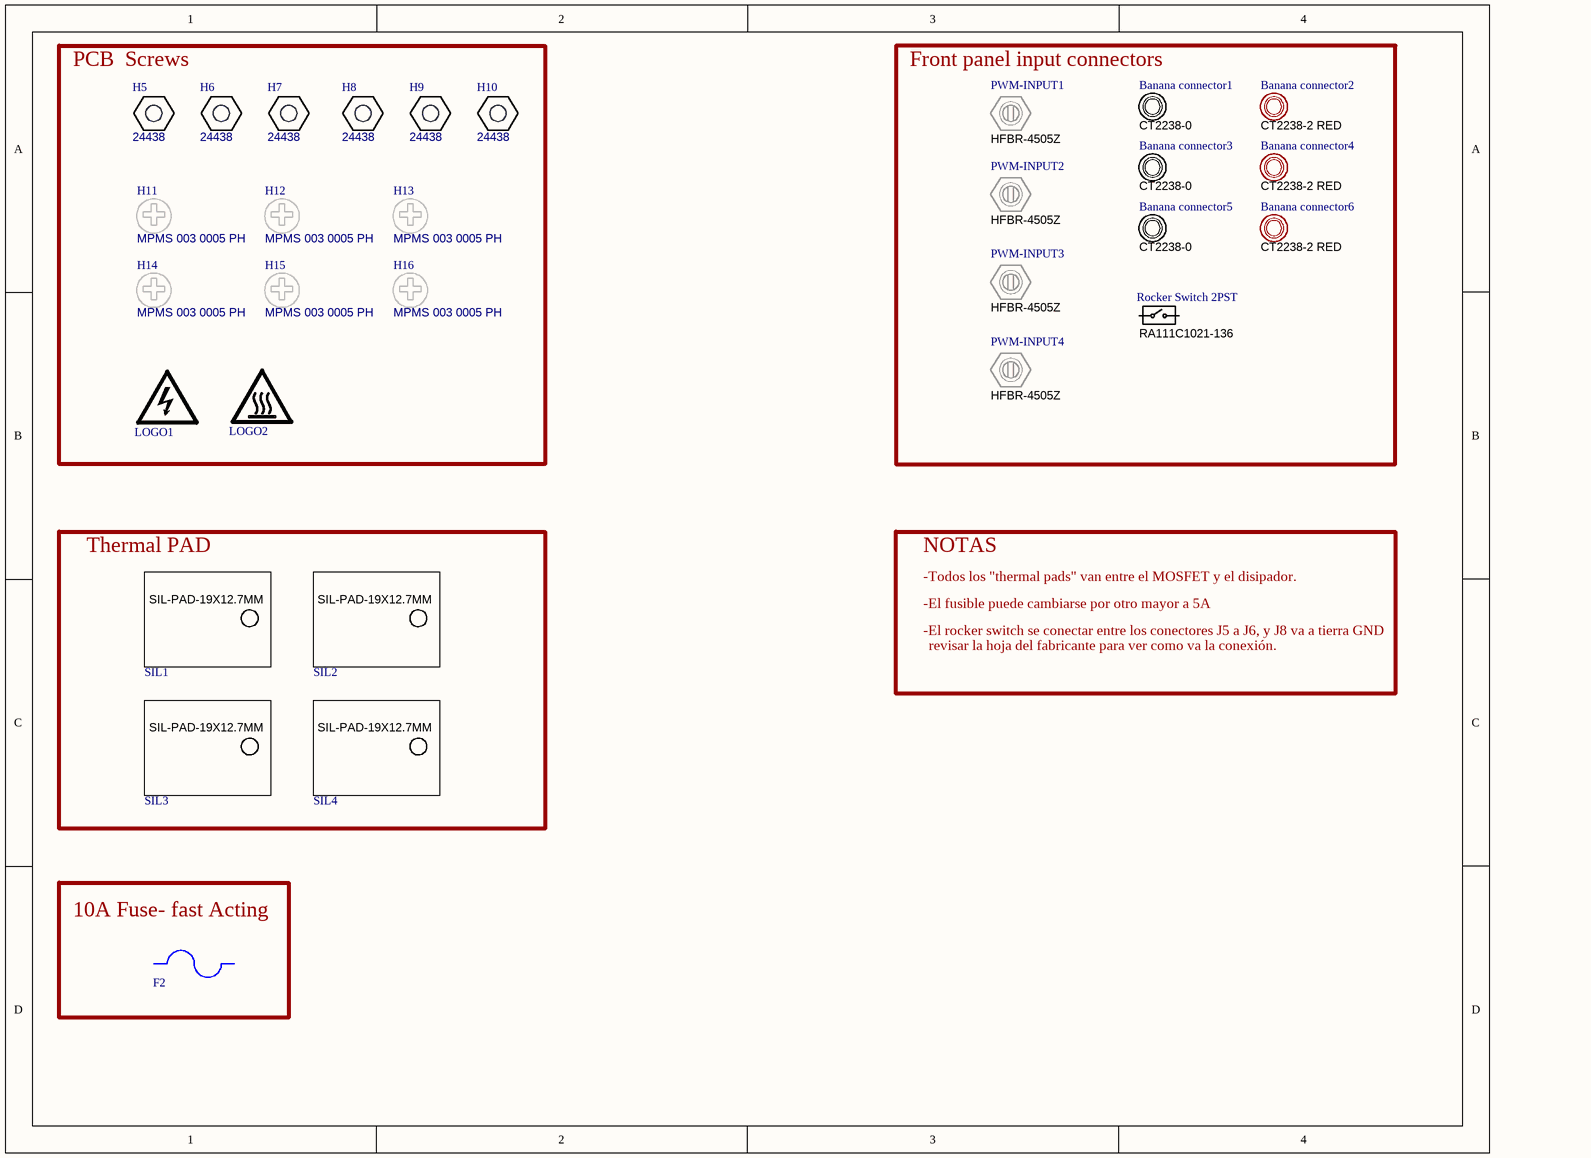
[diagram p3: Hardware.SchDoc]

### Parts
Banana_connector1  CT2238-0  (mechanical)
Banana_connector2  CT2238-2 RED  (mechanical)
Banana_connector3  CT2238-0  (mechanical)
Banana_connector4  CT2238-2 RED  (mechanical)
Banana_connector5  CT2238-0  (mechanical)
Banana_connector6  CT2238-2 RED  (mechanical)
F2  5SF 10-R  (value not drawn)  (mechanical)
H5  24438  [Keystone24438]
H6  24438  [Keystone24438]
H7  24438  [Keystone24438]
H8  24438  [Keystone24438]
H9  24438  [Keystone24438]
H10  24438  [Keystone24438]
H11  MPMS 003 0005 PH  [BuildingFastener_MPMS_003_0005_PH]
H12  MPMS 003 0005 PH  [BuildingFastener_MPMS_003_0005_PH]
H13  MPMS 003 0005 PH  [BuildingFastener_MPMS_003_0005_PH]
H14  MPMS 003 0005 PH  [BuildingFastener_MPMS_003_0005_PH]
H15  MPMS 003 0005 PH  [BuildingFastener_MPMS_003_0005_PH]
H16  MPMS 003 0005 PH  [BuildingFastener_MPMS_003_0005_PH]
LOGO1  DANGER HIGH VOLTAGE  [IEC_HighVoltage_Medium]  (value not drawn)  (no BOM)
LOGO2  CAUTION HOT SURFACE  [IEC_HotSurface_Medium]  (value not drawn)  (no BOM)
PWM-INPUT1  HFBR-4505Z  (mechanical)
PWM-INPUT2  HFBR-4505Z  (mechanical)
PWM-INPUT3  HFBR-4505Z  (mechanical)
PWM-INPUT4  HFBR-4505Z  (mechanical)
Rocker_Switch_2PST  RA111C1021-136  (mechanical)
SIL1  SP900S-0.009-AC-58  [SIL-PAD_19x12.7mm]  (value not drawn)  (mechanical)
SIL2  SP900S-0.009-AC-58  [SIL-PAD_19x12.7mm]  (value not drawn)  (mechanical)
SIL3  SP900S-0.009-AC-58  [SIL-PAD_19x12.7mm]  (value not drawn)  (mechanical)
SIL4  SP900S-0.009-AC-58  [SIL-PAD_19x12.7mm]  (value not drawn)  (mechanical)

### Blocks framed on the sheet
PCB  Screws: H5-H16 LOGO1 LOGO2
Front panel input connectors: Banana_connector1-Banana_connector6 PWM-INPUT1-PWM-INPUT4 Rocker_Switch_2PST
Thermal PAD: SIL1-SIL4
10A Fuse- fast Acting: F2

### Notes on the sheet
- NOTAS
- -Todos los "thermal pads" van entre el MOSFET y el disipador.
- -El fusible puede cambiarse por otro mayor a 5A
- -El rocker switch se conectar entre los conectores J5 a J6, y J8 va a tierra GND
- revisar la hoja del fabricante para ver como va la conexión.
- (in symbol SP900S-0.009-AC-58) SIL-PAD-19X12.7MM

### Library data of the parts
Banana_connector1 Banana_connector3 Banana_connector5 = CT2238-0: Cable Assembly 4MM Safety Jack, Panel W/.25 Fast on Terminal Black; Manufacturer: Cal Test Electronics; Supplier 1: Digi-Key; Supplier Part Number 1: BKCT2238-0-ND; Manufacturer Part Number: CT2238-0; RoHS: No; Stock 1: 1448; Pricing 1: 1=2,00000 (USD)
Banana_connector2 Banana_connector4 Banana_connector6 = CT2238-2: Cable Assembly 4MM Safety Jack, Panel W/.25 Fast on Terminal Red; Manufacturer: Cal Test Electronics; Manufacturer Part Number: CT2238-0; Supplier 1: Digi-Key; Supplier Part Number 1: BKCT2238-0-ND; RoHS: No; Stock 1: 1448; Pricing 1: 1=2,00000 (USD)
F2 = 5SF 10-R: Fuse, 10 A, 250 VAC, N/A; Manufacturer: Bel Fuse; SymbolCreator: a0412235; VAC_V: 250; Interrupt_AC: 100; Irating_A: 10; Rtyp_Ohm: 0.006; MeltingTyp: 163; SymbolVersion: 2013-06-05; PartNumber: 5SF 10-R; MountType: N/A; CompType: Fuse; RoHS: Y; Published: 2009-03-05; Publisher: Texas Instruments; LatestRevisionDate: 2016-05-23; ComponentLink1Description: Datasheet URL; ComponentLink1URL: http://belfuse.com/pdfs/5SF.pdf; Supplier 1: Digi-Key; Supplier Part Number 1: 507-1235-ND; Supplier 2: Mouser; Supplier Part Number 2: 530-5SF10-R
H5-H10 = CMP-0003640-1: Standoff, Hex,25mm Length, M3, Aluminum; Manufacturer: Keystone; CompType: Hardware; ComponentLink1URL: http://www.keyelco.com/userAssets/file/M60-2p72.pdf; Key: 24438; Publisher: Texas Instruments; Supplier Part Number 2: 534-24438; Supplier 1: Digi-Key; PackageReference: Standoff M3; LatestRevisionDate: 2017-03-09; RoHS: Y; Supplier Part Number 1: 36-24438-ND; MountType: TH; Supplier 2: Mouser; PartNumber: 24438; ComponentLink1Description: Datasheet Link
H11-H16 = CMP-0003646-1: MACHINE SCREW PAN PHILLIPS M3 5mm; Manufacturer: B&F Fastener Supply; CompType: Hardware; ComponentLink1URL: http://www.fasnetdirect.com/refguide/MetD7985a.pdf; Key: MPMS 003 0005 PH; Publisher: Texas Instruments; PackageReference: Screw M3 Phillips head; LatestRevisionDate: 2017-03-09; ClassName: Screw; RoHS: Y; MountType: N/A; PartNumber: MPMS 003 0005 PH; ComponentLink1Description: Datasheet Link; Supplier 1: Digi-Key; Supplier Part Number 1: H742-ND
LOGO1 = CMP-0074835-1: IEC 61010-1 High Voltage Warning; SymbolCreator: a0412235; Lib Reference: IEC_HighVoltage; SymbolVersion: 2011-08-22; Published: 2009-03-03; Publisher: Texas Instruments; LatestRevisionDate: 2017-07-06; PartNumber: DANGER HIGH VOLTAGE; Library Reference: IEC_HighVoltage
LOGO2 = CMP-0074837-1: IEC 61010-1 Hot Surface Warning; SymbolCreator: a0412235; Lib Reference: IEC_HotSurface; SymbolVersion: 2011-08-22; Published: 2009-03-03; Publisher: Texas Instruments; LatestRevisionDate: 2017-07-06; PartNumber: CAUTION HOT SURFACE; Library Reference: IEC_HotSurface
PWM-INPUT1-PWM-INPUT4 = HFBR-4505Z: Conn POF Adapter Simplex F/F ST Panel Mount; Manufacturer: Broadcom Avago; Body Material: Plastic; Simplex/Duplex: Duplex; Gender: Male; Mode: Singlemode; Supplier 1: Digi-Key; Supplier Part Number 1: 516-1748-ND; Manufacturer Part Number: HFBR-4505Z; RoHS: Yes; Category: Fiber Optics; Stock 1: 6533; Pricing 1: 1=1,88000, 10=1,19200, 100=0,88240, 500=0,81090, 1000=0,66780, 2000=0,63441, 5000=0,63000 (USD); Mount: Panel,Bulkhead; Color: Grey; Housing Color: Grey; Material: Plastic; Housing Material: Plastic; Min Operating Temperature: -40°C; Max Operating Temperature: 85°C; Package Quantity: 500; Packaging: Bulk; Orientation: Straight; Series: -; Port Type: SIMPLEX; Length: 30mm; Depth: 11mm; REACH SVHC: No SVHC; Lead Free: Lead Free; RoHS Compliant: Yes
Rocker_Switch_2PST = RA111C1021-136: Illuminated Rocker Switches 16A 125VAC 4.8mm Tab Off-On; Manufacturer: E-Switch; Illumination Type: LED,Neon; Illumination Color: Green; Voltage Rating (AC): 125V; Throw Configuration: SPST; Electrical Life: 10000Cycles; Switch Function: On-Off; Supplier 1: Digi-Key; Supplier Part Number 1: RA111C1021-136-ND; Manufacturer Part Number: RA111C1021-136; RoHS: Yes; Category: Rocker Switches; Stock 1: 790; Pricing 1: 1=1,18000, 10=1,05800, 25=1,00160, 50=0,95480, 100=0,90790, 250=0,87048, 500=0,81900, 1000=0,77220 (USD); Mount: Panel,Snap in; Color: Black; Contact Plating: Silver; Housing Material: Polyamide; Min Operating Temperature: -20°C; Max Operating Temperature: 55°C; Package Quantity: 1; Current Rating: 16A; Packaging: Bulk; Termination: Quick Connect; Series: RA1, LAMB; RoHS Compliant: Yes; ComponentLink1URL: https://datasheet.ciiva.com/6470/ra1-6470604.pdf?src-supplier=Digi-Key; ComponentLink1Description: https://datasheet.ciiva.com/6470/ra1-6470604.pdf?src-supplier=Digi-Key
SIL1-SIL4 = SP900S-0.009-AC-58: Silcon Thermal Pad; Manufacturer: Bergquist Company; SymbolCreator: a0411947; SymbolVersion: 2016-05-23; ClassName: Thermal; CompType: Thermal Pad; PartNumber: SP900S-0.009-AC-58; RoHS: Y; PackageReference: 19x12.7 mm; MountType: N/A; ComponentLink1Description: Datasheet Link; ComponentLink1URL: http://www.bergquistcompany.com/pdfs/dataSheets/PDS_QP_3_12.08_E.pdf; Publisher: Texas Instruments; LatestRevisionDate: 2016-05-23; Supplier 1: Digi-Key; Supplier Part Number 1: BER183-ND; Supplier 2: Mouser; Supplier Part Number 2: 951-SP900S-009-AC-58